# EAGLE board Hackerboat Control Board (EAGLE 6.5.0)
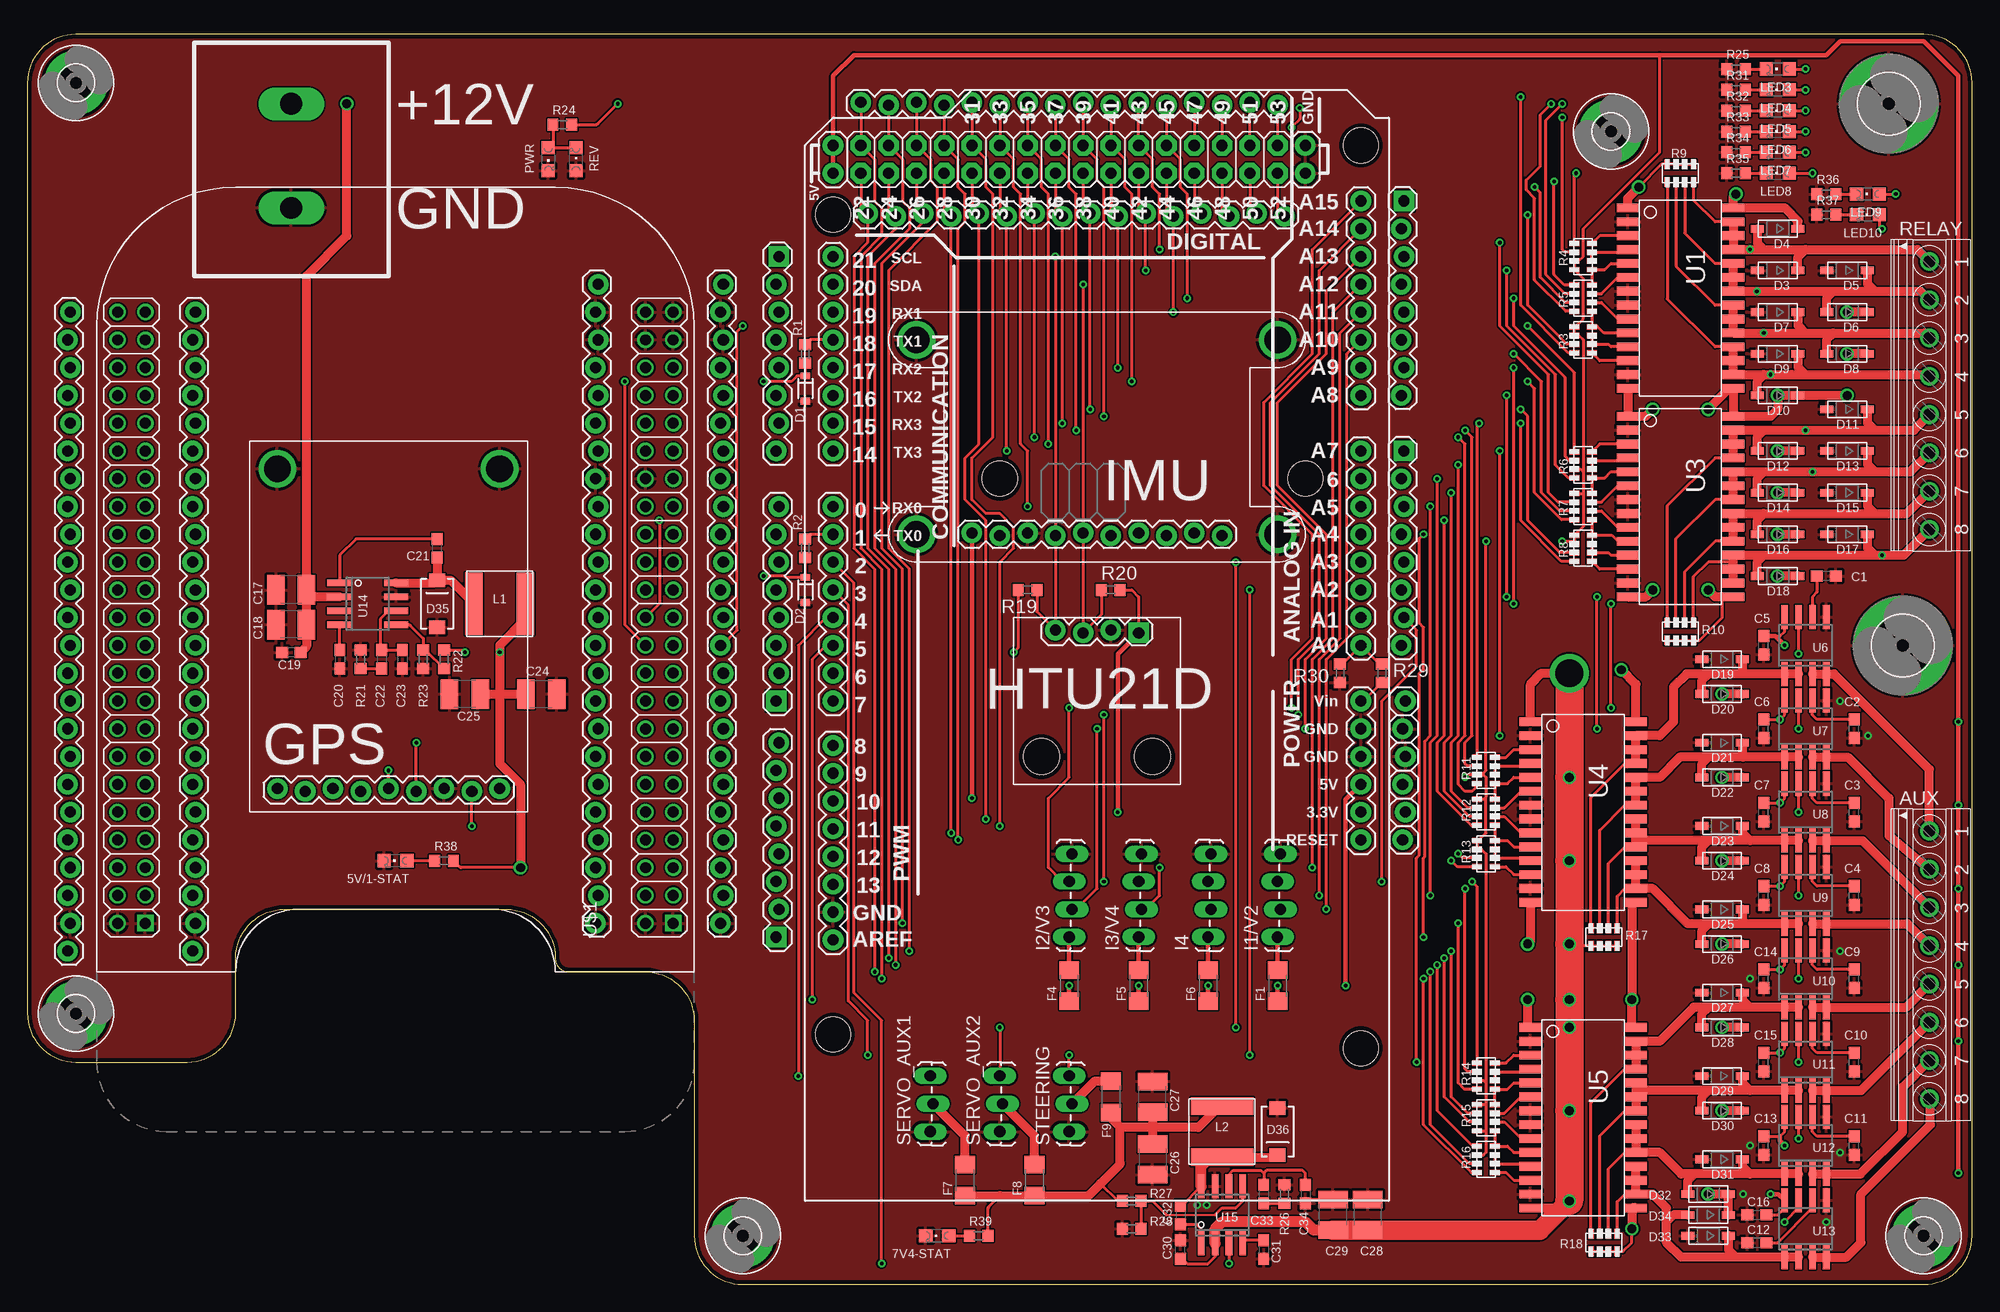
[diagram p7: board, top side]
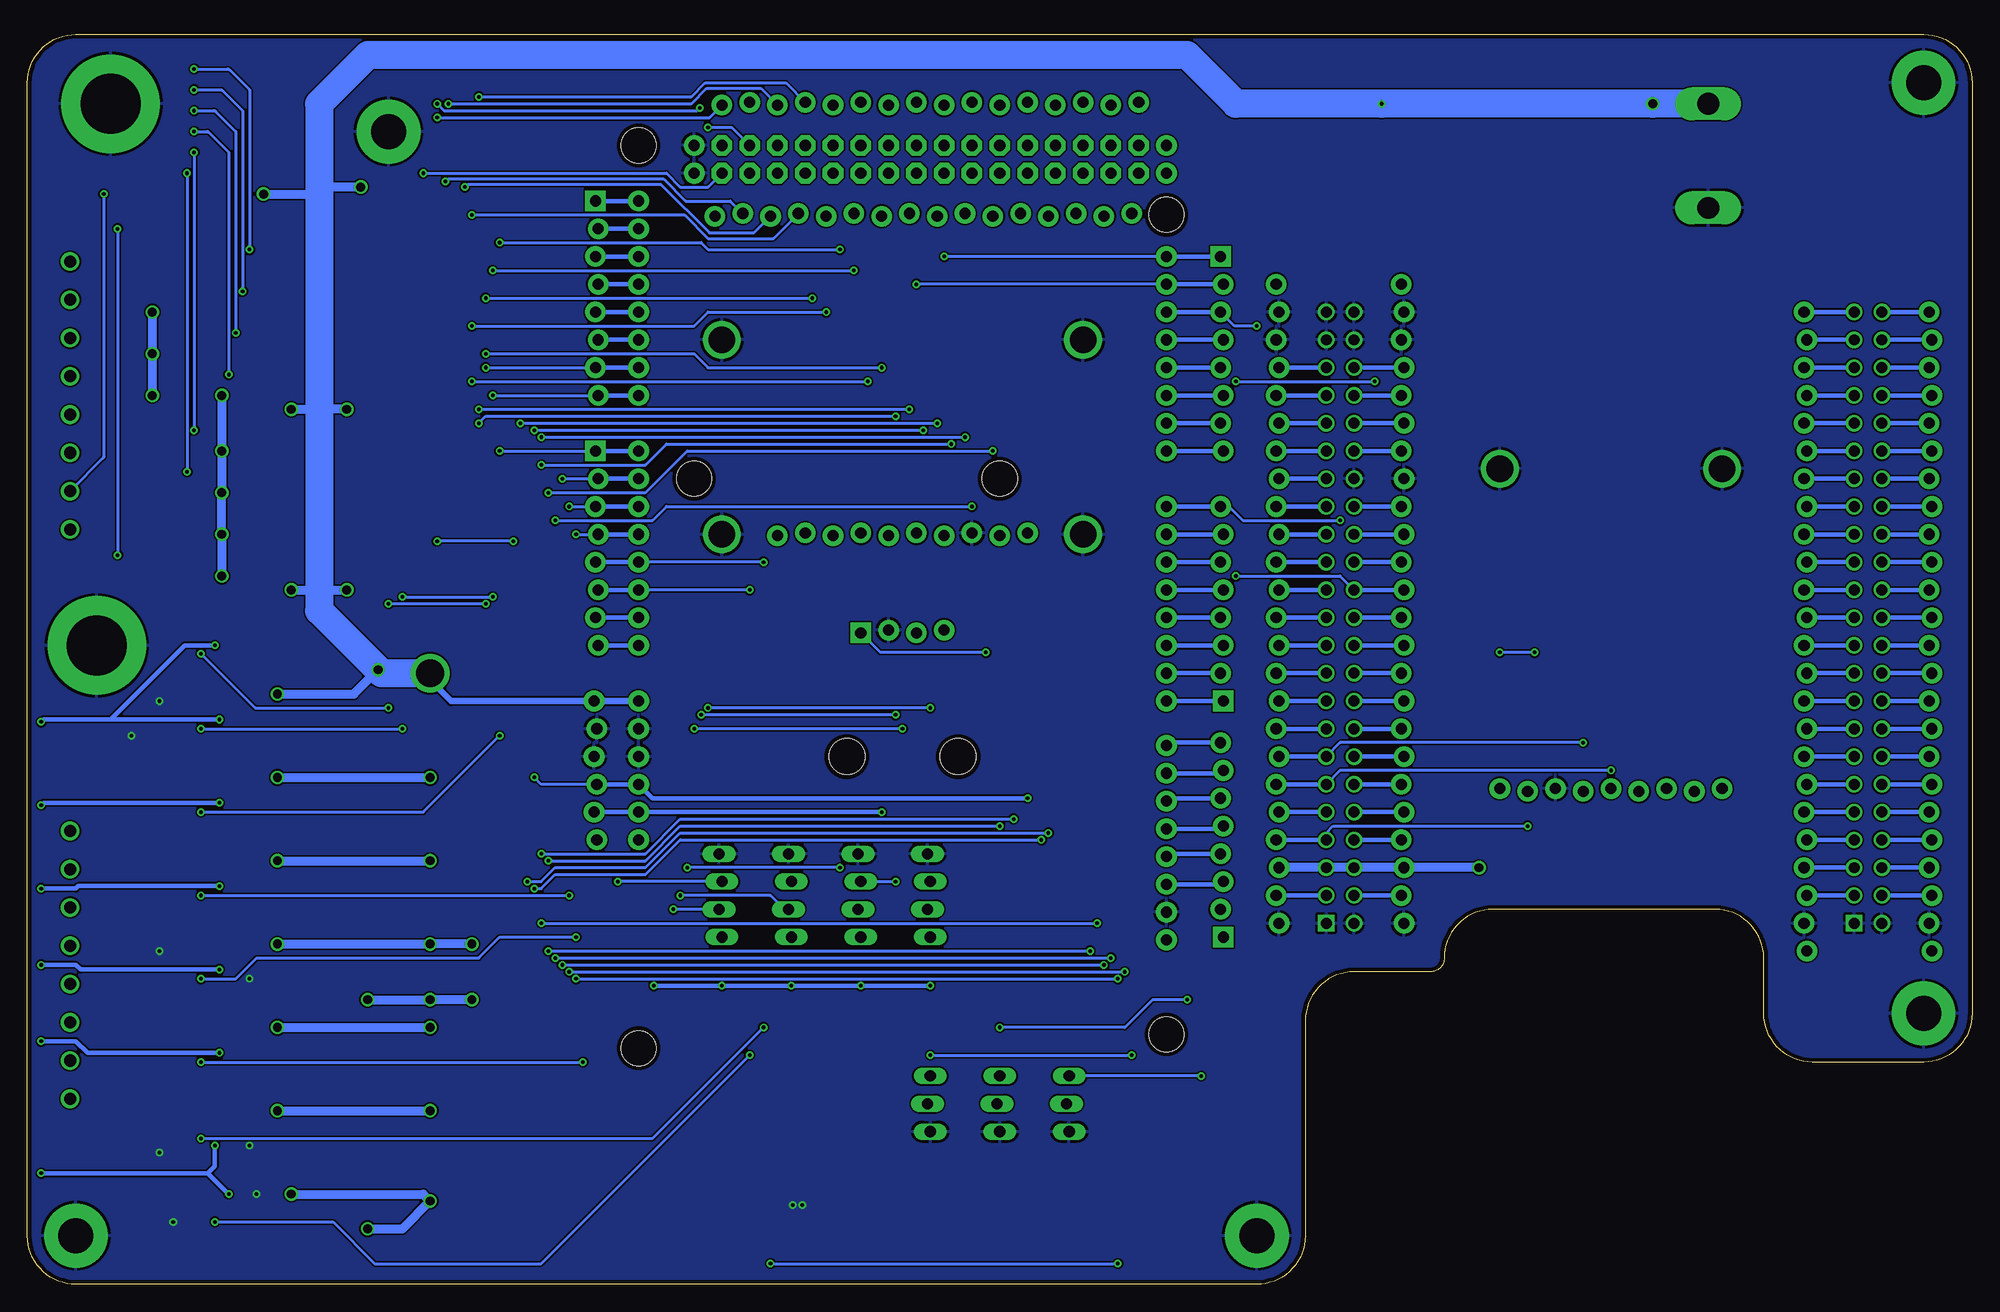
[diagram p8: board, bottom side, seen from below]

Size 177.8 x 114.3 mm. Coordinates in mm from the lower left corner, seen from the top.
Outline: 60.96,24.13 60.96,4.45 arc90 65.41,0 173.35,0 arc90 177.8,4.45 177.8,109.86 arc90 173.35,114.3 4.45,114.3 arc90 0,109.86 0,24.77 arc90 4.45,20.32 14.61,20.32 arc90 19.05,24.77 19.05,29.84 arc-90 23.5,34.29 43.81,34.29 arc-90 48.26,29.84 arc90 49.53,28.57 56.52,28.57 arc-90 60.96,24.13
Copper layers (1*16): Top 0.0356mm / dielectric 1.5011mm / Bottom 0.0356mm
Design rules "LaenPCBOrder *": minimum track width 6mil, minimum drill 13mil, track to track 6mil, track to pad 6mil, pad to pad 6mil, via to via 6mil, smd to smd 6mil, copper to edge 15mil, drill to drill 6mil, minimum pad ring 7mil, minimum via ring 7mil, stop-mask expansion 4mil, vias tented up to drill 15mil, thermal gap 10mil

## Footprints (pad centres in the part's own frame; a part is rotated, then mirrored left to right if it is on the bottom)
CHIPLED_0805 = smd 1.2 x 1.2: A 0,-1.05; C 0,1.05
1751303 = drill 1.1 pad 1.7: 1 -12.25,-0.1; 2 -8.75,-0.1; 3 -5.25,-0.1; 4 -1.75,-0.1; 5 1.75,-0.1; 6 5.25,-0.1; 7 8.75,-0.1; 8 12.25,-0.1
C0603 = smd 1.1 x 1: 1 -0.85,0; 2 0.85,0
C1210 = smd 1.6 x 2.7: 1 -1.4,0; 2 1.4,0
SOD-323 = smd 0.63 x 0.83: A 1.15,0; C -1.15,0
SOD-123 = smd 1.2 x 0.7: A 1.85,0; C -1.85,0
SPARKFUN_SMA-DIODE = smd 1.27 x 1.47: A -2.15,0; C 2.15,0
R1206 = smd 1.6 x 1.803: 1 -1.422,0; 2 1.422,0
ULTIMATE-GPS = drill 1.016 pad 1.88: 3V3 2.54,2.159; EN 5.08,1.905; FIX 10.16,1.905; GND 17.78,2.159; PPS 22.86,2.159; RX 15.24,1.905; TX 12.7,2.159; VBAT 7.62,2.159; VIN 20.32,1.905 | drill 2.438: MNT@0 2.54,31.394; MNT@1 22.86,31.394
3,2-PAD = drill 3.2 pad 5.842: B3,2 0,0
5,5-PAD = drill 5.5 pad 9: B5,5 0,0
HTU21D = drill 1.016 pad 1.88 square: 3V3 -3.81,1.397 | drill 1.016 pad 1.88: GND -1.27,1.143; SCL 3.81,1.143; SDA 1.27,1.397 | hole 3.302: -5.08,12.7; 5.08,12.7
1X04_LOCK_LONGPADS = drill 1.016 long: 1 0,0; 2 2.54,-0.254; 3 5.08,0; 4 7.62,-0.254
9-DOF-BREAKOUT = drill 1.016 pad 1.88: 3VO -8.89,2.413; GINT 1.27,2.413; GND -6.35,2.667; GRDY 3.81,2.667; LIN1 6.35,2.413; LIN2 8.89,2.667; LRDY 11.43,2.413; SCL -3.81,2.413; SDA -1.27,2.667; VIN -11.43,2.667 | drill 2.438: MNT@0 -16.51,2.54; MNT@1 -16.51,20.32; MNT@2 16.51,20.32; MNT@3 16.51,2.54
CONN-2 = drill 2 long: 1 -5.08,0; 2 4.445,0
1X08_LOCK = drill 1.016 pad 1.88 square: 1 0,0.127 | drill 1.016 pad 1.88: 2 2.54,-0.127; 3 5.08,0.127; 4 7.62,-0.127; 5 10.16,0.127; 6 12.7,-0.127; 7 15.24,0.127; 8 17.78,-0.127
1X16_LOCK = drill 1.016 pad 1.88: 1 0,0.127; 2 2.54,-0.127; 3 5.08,0.127; 4 7.62,-0.127; 5 10.16,0.127; 6 12.7,-0.127; 7 15.24,0.127; 8 17.78,-0.127; 9 20.32,0.127; 10 22.86,-0.127; 11 25.4,0.127; 12 27.94,-0.127; 13 30.48,0.127; 14 33.02,-0.127; 15 35.56,0.127; 16 38.1,-0.127
1X06_LOCK = drill 1.016 pad 1.88: 1 0,0; 2 2.54,-0.254; 3 5.08,0; 4 7.62,-0.254; 5 10.16,0; 6 12.7,-0.254
NR60XX = smd 5.7 x 1.6: 1 0,2.35; 2 0,-2.35
R0603 = smd 1 x 1.1: 1 -0.85,0; 2 0.85,0
CTS742C083-RES = smd 0.9 x 0.5: 1 -0.8,1.2; 2 0.8,1.2; 3 -0.8,0.4; 4 0.8,0.4; 5 -0.8,-0.4; 6 0.8,-0.4; 7 -0.8,-1.2; 8 0.8,-1.2
1X03_LOCK_LONGPADS = drill 1.016 long: 1 0,0; 2 2.54,-0.254; 3 5.08,0
SO-28L = smd 0.8 x 2: 1 -8.255,-4.826; 2 -6.985,-4.826; 3 -5.715,-4.826; 4 -4.445,-4.826; 5 -3.175,-4.826; 6 -1.905,-4.826; 7 -0.635,-4.826; 8 0.635,-4.826; 9 1.905,-4.826; 10 3.175,-4.826; 11 4.445,-4.826; 12 5.715,-4.826; 13 6.985,-4.826; 14 8.255,-4.826; 15 8.255,4.826; 16 6.985,4.826; 17 5.715,4.826; 18 4.445,4.826; 19 3.175,4.826; 20 1.905,4.826; 21 0.635,4.826; 22 -0.635,4.826; 23 -1.905,4.826; 24 -3.175,4.826; 25 -4.445,4.826; 26 -5.715,4.826; 27 -6.985,4.826; 28 -8.255,4.826
ARDUINO_MEGA = drill 1.016 pad 1.88: 0 63.5,50.8; 1 60.96,50.8; 2 58.42,50.8; 3 55.88,50.8; 3.3V 35.56,2.54; 4 53.34,50.8; 5 50.8,50.8; 5V@0 38.1,2.54; 5V@1 93.98,50.8; 5V@2 96.52,50.8; 6 48.26,50.8; 7 45.72,50.8; 8 41.656,50.8; 9 39.116,50.8; 10 36.576,50.8; 11 34.036,50.8; 12 31.496,50.8; 13 28.956,50.8; 14 68.58,50.8; 15 71.12,50.8; 16 73.66,50.8; 17 76.2,50.8; 18 78.74,50.8; 19 81.28,50.8; 20 83.82,50.8; 21 86.36,50.8; A0 50.8,2.54; A1 53.34,2.54; A2 55.88,2.54; A3 58.42,2.54; A4 60.96,2.54; A5 63.5,2.54; A6 66.04,2.54; A7 68.58,2.54; A8 73.66,2.54; A9 76.2,2.54; A10 78.74,2.54; A11 81.28,2.54; A12 83.82,2.54; A13 86.36,2.54; A14 88.9,2.54; A15 91.44,2.54; AREF 23.876,50.8; GND@0 40.64,2.54; GND@1 43.18,2.54; GND@2 93.98,7.62; GND@3 96.52,7.62; GND@4 26.416,50.8; RESET 33.02,2.54; VIN 45.72,2.54 | drill 1.016 pad 1.88 octagon: 22 93.98,48.26; 23 96.52,48.26; 24 93.98,45.72; 25 96.52,45.72; 26 93.98,43.18; 27 96.52,43.18; 28 93.98,40.64; 29 96.52,40.64; 30 93.98,38.1; 31 96.52,38.1; 32 93.98,35.56; 33 96.52,35.56; 34 93.98,33.02; 35 96.52,33.02; 36 93.98,30.48; 37 96.52,30.48; 38 93.98,27.94; 39 96.52,27.94; 40 93.98,25.4; 41 96.52,25.4; 42 93.98,22.86; 43 96.52,22.86; 44 93.98,20.32; 45 96.52,20.32; 46 93.98,17.78; 47 96.52,17.78; 48 93.98,15.24; 49 96.52,15.24; 50 93.98,12.7; 51 96.52,12.7; 52 93.98,10.16; 53 96.52,10.16 | hole 3.2: 15.24,50.8; 13.97,2.54; 66.04,35.56; 66.04,7.62; 90.17,50.8; 96.52,2.54
SO08 = smd 0.6 x 2.2: 1 -1.905,-2.6; 2 -0.635,-2.6; 3 0.635,-2.6; 4 1.905,-2.6; 5 1.905,2.6; 6 0.635,2.6; 7 -0.635,2.6; 8 -1.905,2.6
BEAGLEBONE_SHIELD = drill 1 square: 1 4.445,19.05; 47 52.705,19.05 | drill 1: 2 1.905,19.05; 3 4.445,21.59; 4 1.905,21.59; 5 4.445,24.13; 6 1.905,24.13; 7 4.445,26.67; 8 1.905,26.67; 9 4.445,29.21; 10 1.905,29.21; 11 4.445,31.75; 12 1.905,31.75; 13 4.445,34.29; 14 1.905,34.29; 15 4.445,36.83; 16 1.905,36.83; 17 4.445,39.37; 18 1.905,39.37; 19 4.445,41.91; 20 1.905,41.91; 21 4.445,44.45; 22 1.905,44.45; 23 4.445,46.99; 24 1.905,46.99; 25 4.445,49.53; 26 1.905,49.53; 27 4.445,52.07; 28 1.905,52.07; 29 4.445,54.61; 30 1.905,54.61; 31 4.445,57.15; 32 1.905,57.15; 33 4.445,59.69; 34 1.905,59.69; 35 4.445,62.23; 36 1.905,62.23; 37 4.445,64.77; 38 1.905,64.77; 39 4.445,67.31; 40 1.905,67.31; 41 4.445,69.85; 42 1.905,69.85; 43 4.445,72.39; 44 1.905,72.39; 45 4.445,74.93; 46 1.905,74.93; 48 50.165,19.05; 49 52.705,21.59; 50 50.165,21.59; 51 52.705,24.13; 52 50.165,24.13; 53 52.705,26.67; 54 50.165,26.67; 55 52.705,29.21; 56 50.165,29.21; 57 52.705,31.75; 58 50.165,31.75; 59 52.705,34.29; 60 50.165,34.29; 61 52.705,36.83; 62 50.165,36.83; 63 52.705,39.37; 64 50.165,39.37; 65 52.705,41.91; 66 50.165,41.91; 67 52.705,44.45; 68 50.165,44.45; 69 52.705,46.99; 70 50.165,46.99; 71 52.705,49.53; 72 50.165,49.53; 73 52.705,52.07; 74 50.165,52.07; 75 52.705,54.61; 76 50.165,54.61; 77 52.705,57.15; 78 50.165,57.15; 79 52.705,59.69; 80 50.165,59.69; 81 52.705,62.23; 82 50.165,62.23; 83 52.705,64.77; 84 50.165,64.77; 85 52.705,67.31; 86 50.165,67.31; 87 52.705,69.85; 88 50.165,69.85; 89 52.705,72.39; 90 50.165,72.39; 91 52.705,74.93; 92 50.165,74.93
1X24_LOCK = drill 1.016 pad 1.88: 2 -26.67,0.127; 3 -24.13,-0.127; 4 -21.59,0.127; 5 -19.05,-0.127; 6 -16.51,0.127; 7 -13.97,-0.127; 8 -11.43,0.127; 9 -8.89,-0.127; 10 -6.35,0.127; 11 -3.81,-0.127; 12 -1.27,0.127; 13 1.27,-0.127; 14 3.81,0.127; 15 6.35,-0.127; 16 8.89,0.127; 17 11.43,-0.127; 18 13.97,0.127; 19 16.51,-0.127; 20 19.05,0.127; 21 21.59,-0.127; 22 24.13,0.127; 23 26.67,-0.127; 24 29.21,0.127; 25 31.75,-0.127

## Placement (x,y rotation side)
5V/1-STAT  [CHIPLED_0805]  33.66,38.73 90 top
7V4-STAT  [CHIPLED_0805]  83.19,4.45 90 top
AUX  1751303  [1751303]  173.99,29.21 270 top
C1  1n  [C0603]  164.47,64.77 180 top
C2  1n  [C0603]  167,50.8 90 top
C3  1n  [C0603]  167,43.18 90 top
C4  1n  [C0603]  167,35.56 90 top
C5  100n  [C0603]  158.75,58.42 90 top
C6  100n  [C0603]  158.75,50.8 90 top
C7  100n  [C0603]  158.75,43.18 90 top
C8  100n  [C0603]  158.75,35.56 90 top
C9  1n  [C0603]  167,27.94 90 top
C10  1n  [C0603]  167,20.32 90 top
C11  1n  [C0603]  167,12.7 90 top
C12  1n  [C0603]  158.12,3.81 0 top
C13  100n  [C0603]  158.75,12.7 90 top
C14  100n  [C0603]  158.75,27.94 90 top
C15  100n  [C0603]  158.75,20.32 90 top
C16  100n  [C0603]  158.12,6.35 0 top
C17  4u7  [C1210]  24.13,63.5 180 top
C18  4u7  [C1210]  24.13,60.33 180 top
C19  10n  [C0603]  24.13,57.78 180 top
C20  2n  [C0603]  28.57,57.15 270 top
C21  100n  [C0603]  37.47,67.31 90 top
C22  [C0603]  32.38,57.15 270 top
C23  [C0603]  34.29,57.15 270 top
C24  [C1210]  46.99,53.98 0 top
C25  [C1210]  40.01,53.98 180 top
C26  [C1210]  102.87,11.43 270 top
C27  [C1210]  102.87,17.14 90 top
C28  4u7  [C1210]  122.56,6.35 90 top
C29  4u7  [C1210]  119.38,6.35 90 top
C30  10n  [C0603]  105.41,3.17 90 top
C31  2n  [C0603]  113.03,3.17 270 top
C32  100n  [C0603]  105.41,6.35 270 top
C33  [C0603]  113.03,8.26 270 top
C34  [C0603]  116.84,8.26 270 top
D1  3.3V  [SOD-323]  71.12,81.92 270 top
D2  3.3V  [SOD-323]  71.12,63.5 270 top
D3  [SOD-123]  160.02,92.71 180 top
D4  [SOD-123]  160.02,96.52 180 top
D5  [SOD-123]  166.37,92.71 180 top
D6  [SOD-123]  166.37,88.9 180 top
D7  [SOD-123]  160.02,88.9 180 top
D8  [SOD-123]  166.37,85.09 180 top
D9  [SOD-123]  160.02,85.09 180 top
D10  [SOD-123]  160.02,81.28 180 top
D11  [SOD-123]  166.37,80.01 180 top
D12  [SOD-123]  160.02,76.2 180 top
D13  [SOD-123]  166.37,76.2 180 top
D14  [SOD-123]  160.02,72.39 180 top
D15  [SOD-123]  166.37,72.39 180 top
D16  [SOD-123]  160.02,68.58 180 top
D17  [SOD-123]  166.37,68.58 180 top
D18  [SOD-123]  160.02,64.77 180 top
D19  [SOD-123]  154.94,57.15 180 top
D20  [SOD-123]  154.94,53.98 180 top
D21  [SOD-123]  154.94,49.53 180 top
D22  [SOD-123]  154.94,46.35 180 top
D23  [SOD-123]  154.94,41.91 180 top
D24  [SOD-123]  154.94,38.73 180 top
D25  [SOD-123]  154.94,34.29 180 top
D26  [SOD-123]  154.94,31.11 180 top
D27  [SOD-123]  154.94,26.67 180 top
D28  [SOD-123]  154.94,23.5 180 top
D29  [SOD-123]  154.94,19.05 180 top
D30  [SOD-123]  154.94,15.88 180 top
D31  [SOD-123]  154.94,11.43 180 top
D32  [SOD-123]  153.67,8.26 180 top
D33  [SOD-123]  153.67,4.45 180 top
D34  [SOD-123]  153.67,6.35 180 top
D35  [SPARKFUN_SMA-DIODE]  37.47,62.23 90 top
D36  [SPARKFUN_SMA-DIODE]  114.3,13.97 270 top
F1  [R1206]  114.3,27.3 90 top
F4  [R1206]  95.25,27.3 90 top
F5  [R1206]  101.6,27.3 90 top
F6  [R1206]  107.95,27.3 90 top
F7  [R1206]  85.72,9.53 90 top
F8  [R1206]  92.08,9.53 90 top
F9  [R1206]  99.06,17.14 90 top
GPS  ULTIMATE-GPS  [ULTIMATE-GPS]  20.32,43.18 0 top
H1  MOUNT-PAD-ROUND3.2  [3,2-PAD]  173.35,4.45 0 top
H2  MOUNT-PAD-ROUND3.2  [3,2-PAD]  144.78,105.41 0 top
H3  MOUNT-PAD-ROUND3.2  [3,2-PAD]  65.41,4.45 0 top
H4  MOUNT-PAD-ROUND3.2  [3,2-PAD]  4.45,109.86 0 top
H5  MOUNT-PAD-ROUND5.5  [5,5-PAD]  171.45,58.42 0 top
H6  MOUNT-PAD-ROUND5.5  [5,5-PAD]  170.18,107.95 0 top
H7  MOUNT-PAD-ROUND3.2  [3,2-PAD]  4.45,24.77 0 top
HTU21D  HTU21D  [HTU21D]  97.79,60.96 180 top
I1/V2  [1X04_LOCK_LONGPADS]  114.3,31.75 90 top
I2/V3  [1X04_LOCK_LONGPADS]  95.25,31.75 90 top
I3/V4  [1X04_LOCK_LONGPADS]  101.6,31.75 90 top
I4  [1X04_LOCK_LONGPADS]  107.95,31.75 90 top
IMU  9-DOF-BREAKOUT  [9-DOF-BREAKOUT]  97.79,66.04 0 top
J3  3-1437664-0  [CONN-2]  24.13,102.87 270 top
JP10  [1X08_LOCK]  68.58,53.34 90 top
JP11  [1X08_LOCK]  125.73,76.2 270 top
JP12  [1X08_LOCK]  125.73,99.06 270 top
JP13  [1X08_LOCK]  68.58,93.98 270 top
JP14  [1X08_LOCK]  68.58,31.75 90 top
JP15  M16LOCK  [1X16_LOCK]  114.94,97.79 180 top
JP16  M16LOCK  [1X16_LOCK]  114.3,107.95 180 top
JP17  [1X06_LOCK]  125.73,40.64 90 top
L1  NR6045  [NR60XX]  43.18,62.23 90 top
L2  NR6045  [NR60XX]  109.22,13.97 180 top
LED3  [CHIPLED_0805]  160.02,111.12 90 top
LED4  [CHIPLED_0805]  160.02,109.22 90 top
LED5  [CHIPLED_0805]  160.02,107.31 90 top
LED6  [CHIPLED_0805]  160.02,105.41 90 top
LED7  [CHIPLED_0805]  160.02,103.5 90 top
LED8  [CHIPLED_0805]  160.02,101.6 90 top
LED9  [CHIPLED_0805]  168.28,99.69 90 top
LED10  [CHIPLED_0805]  168.28,97.79 90 top
PWR  [CHIPLED_0805]  47.62,102.87 180 top
R1  1K  [R0603]  71.12,85.09 270 top
R2  1K  [R0603]  71.12,67.31 90 top
R3  10K  [CTS742C083-RES]  142.24,86.36 0 top
R4  10k  [CTS742C083-RES]  142.24,93.98 0 top
R5  10K  [CTS742C083-RES]  142.24,90.17 0 top
R6  10K  [CTS742C083-RES]  142.24,74.93 0 top
R7  10K  [CTS742C083-RES]  142.24,71.12 0 top
R8  10K  [CTS742C083-RES]  142.24,67.31 0 top
R9  100K  [CTS742C083-RES]  151.13,101.6 90 top
R10  100K  [CTS742C083-RES]  151.13,59.69 270 top
R11  10K  [CTS742C083-RES]  133.35,46.99 0 top
R12  10K  [CTS742C083-RES]  133.35,43.18 0 top
R13  10K  [CTS742C083-RES]  133.35,39.37 0 top
R14  10K  [CTS742C083-RES]  133.35,19.05 0 top
R15  10K  [CTS742C083-RES]  133.35,15.24 0 top
R16  10K  [CTS742C083-RES]  133.35,11.43 0 top
R17  100K  [CTS742C083-RES]  144.15,31.75 270 top
R18  100K  [CTS742C083-RES]  144.15,3.81 270 top
R19  4K7'  [R0603]  91.44,63.5 180 top
R20  4K7  [R0603]  99.06,63.5 0 top
R21  [R0603]  30.48,57.15 270 top
R22  [R0603]  38.1,57.15 90 top
R23  [R0603]  36.2,57.15 90 top
R24  [R0603]  48.9,106.05 0 top
R25  [R0603]  156.21,111.12 0 top
R26  [R0603]  114.94,8.26 270 top
R27  [R0603]  100.97,7.62 180 top
R28  [R0603]  100.97,5.08 0 top
R29  15K  [R0603]  123.83,55.88 270 top
R30  10K  [R0603]  120.02,55.88 90 top
R31  [R0603]  156.21,109.22 0 top
R32  [R0603]  156.21,107.31 0 top
R33  [R0603]  156.21,105.41 0 top
R34  [R0603]  156.21,103.5 0 top
R35  [R0603]  156.21,101.6 0 top
R36  [R0603]  164.47,99.69 0 top
R37  [R0603]  164.47,97.79 0 top
R38  [R0603]  38.1,38.73 0 top
R39  [R0603]  87,4.45 0 top
RELAY  1751303  [1751303]  173.99,81.28 270 top
REV  [CHIPLED_0805]  50.16,102.87 0 top
SERVO_AUX1  [1X03_LOCK_LONGPADS]  82.55,13.97 90 top
SERVO_AUX2  [1X03_LOCK_LONGPADS]  88.9,13.97 90 top
STEERING  [1X03_LOCK_LONGPADS]  95.25,13.97 90 top
U1  IPS6044  [SO-28L]  151.13,90.17 270 top
U2  ARDUINO-MEGAFULL  [ARDUINO_MEGA]  124.46,7.62 90 top
U3  IPS6044  [SO-28L]  151.13,71.12 270 top
U4  IPS6044  [SO-28L]  142.24,43.18 270 top
U5  IPS6044  [SO-28L]  142.24,15.24 270 top
U6  [SO08]  162.56,58.42 0 top
U7  [SO08]  162.56,50.8 0 top
U8  [SO08]  162.56,43.18 0 top
U9  [SO08]  162.56,35.56 0 top
U10  [SO08]  162.56,27.94 0 top
U11  [SO08]  162.56,20.32 0 top
U12  [SO08]  162.56,12.7 0 top
U13  [SO08]  162.56,5.08 0 top
U14  TPS54331  [SO08]  31.11,62.23 270 top
U15  TPS54331  [SO08]  109.22,6.35 0 top
U$1  BEAGLEBONE_OUTLINE  [BEAGLEBONE_SHIELD]  6.35,13.97 0 top
U$2  M24LOCK  [1X24_LOCK]  52.07,64.77 270 top
U$3  M24LOCK  [1X24_LOCK]  3.81,62.23 270 top
U$4  M24LOCK  [1X24_LOCK]  15.24,62.23 270 top
U$5  M24LOCK  [1X24_LOCK]  63.5,64.77 270 top

## Tracks (layer width: path | path; a pad name or v marks a point on that pad's centre or on a via)
7V4
  Top 0.254: R27.2 99.69,7.62 98.11,9.21 | R39.2 87.84,6.94 arc-45 87.92,7.12 88.9,8.1
  Top 0.813: F7.1 88.9,8.1 F8.1 97,8.1 98.11,9.21 99.83,10.93 arc45 99.9,11.11 99.9,14.36 arc45 99.88,14.43 | L2.2 109.03,16.32 107.06,14.35 102.87,14.35 | C27.1 102.87,14.35 | 102.87,14.35 C26.1 | 102.87,14.35 100.05,14.35 arc-45 99.88,14.43 | 99.88,14.43 99.06,15.24 F9.1
13
  Bottom 0.406: U2.13 68.71,36.58 JP14.3
+3V3  (via drill 0.33)
  Top 0.254: R19.2 90.59,58.2 v90.17,57.78 | R20.2 100.97,63.5 101.6,62.87 HTU21D.3V3
  Top 0.406: v99.69,43.18 99.69,57.66 HTU21D.3V3
  Bottom 0.254: v90.17,57.78 99.82,57.78 HTU21D.3V3
  Bottom 0.406: JP17.2 U2.3.3V v99.69,43.18
+5V  (via drill 0.33)
  Top 0.254: C5.2 160.24,59.27 160.66,59.69 U6.8 | C6.2 v160.24,51.65 160.66,52.07 U7.8 | C8.2 v160.24,36.41 160.66,36.83 U9.8 | C7.2 v160.24,44.03 160.66,44.45 U8.8 | C13.2 160.24,13.55 160.66,13.97 U12.8 | C16.2 160.02,6.35 160.66,6.99 U13.8 | C15.2 v160.24,21.17 160.66,21.59 U11.8 | C14.2 v160.24,28.79 160.66,29.21 U10.8 | 133.12,46.59 R11.5 131.68,46.59 v131.44,46.35 | 133.12,46.59 133.35,46.35 133.35,44.58 | R12.1 133.15,44.38 133.35,44.58 | 133.35,44.58 133.35,41.27 132.65,40.57 R13.1 R13.3 132.95,39.77 133.35,39.37 133.35,18.41 | 142.24,74.3 142.24,86.36 141.84,86.76 R3.3 R3.1 141.53,87.56 142.24,88.27 142.24,91.98 R4.7 R4.5 141.84,93.58 142.24,93.98 142.24,96.52 149.22,103.5 149.22,112.39 | 142.24,74.3 142.24,72.39 | 142.24,72.39 142.24,69.31 R8.1 R8.3 141.21,67.94 v140.34,67.94 | R7.1 142.17,72.32 142.24,72.39 | R6.5 142,74.53 142.24,74.3 | 133.12,46.59 133.12,46.76 133.35,46.99 v133.35,67.94 | 133.35,18.41 133.35,16.51 | 133.35,16.51 133.35,13.97 | 133.35,13.97 133.35,12.06 133.12,11.83 R16.3 | R15.1 133.28,16.44 133.35,16.51 | R14.5 133.12,18.65 133.35,18.41 | R15.7 133.28,14.04 133.35,13.97
  Top 0.406: v120.52,27.3 120.52,44.32 U2.5V@0 | IMU.VIN v86.36,44.45 | v176.53,10.16 v176.53,22.23 v176.53,29.21 v176.53,36.2 v176.53,43.81 v176.53,51.44 176.53,110.49 173.35,113.67 165.74,113.67 164.47,112.39 149.22,112.39 75.56,112.39 73.66,110.49 U2.5V@2 U2.5V@1 | v159.38,8.26 160.08,8.26 U13.8 | 160.24,13.55 160.24,13.12 v160.66,12.7 | C5.2 159.81,59.27 v160.66,58.42 | F4.1 v95.25,27.3 | F5.1 v101.6,27.3 | F6.1 v107.95,27.3 | F1.1 v114.3,27.3
  Bottom 0.254: JP17.3 130.81,45.72 v131.44,46.35 | v133.35,67.94 v140.34,67.94
  Bottom 0.406: JP17.3 U2.5V@0 120.65,44.45 v86.36,44.45 | v176.53,10.16 161.29,10.16 | 161.29,10.16 v159.38,8.26 | v160.66,12.7 160.66,10.79 161.29,10.16 | v160.24,21.17 172.3,21.17 173.35,22.23 v176.53,22.23 | v160.24,28.79 172.94,28.79 173.35,29.21 v176.53,29.21 | v160.24,36.41 173.14,36.41 173.35,36.2 v176.53,36.2 | v160.24,44.03 176.31,44.03 v176.53,43.81 | v160.24,51.65 170.18,51.65 | 170.18,51.65 176.31,51.65 v176.53,51.44 | v160.66,58.42 163.41,58.42 170.18,51.65 | v95.25,27.3 v101.6,27.3 v107.95,27.3 v114.3,27.3 v120.52,27.3
+5V/1  (via drill 0.33, 0.81)
  Top 0.254: R22.2 39.69,58 arc-45 39.86,57.93 v40.01,57.78 | v45.09,38.1 39.69,38.1 arc-45 39.51,38.17 R38.2
  Top 0.813: 43.18,53.98 C24.1 | L1.2 45.53,60.77 43.18,58.42 v43.18,57.78 43.18,53.98 | 43.18,53.98 43.18,47.62 45.09,45.72 v45.09,38.1 | C25.1 43.18,53.98
  Bottom 0.254: v40.01,57.78 v43.18,57.78
  Bottom 0.813: v45.09,38.1 U$2.23 U$1.52 U$1.51 U$5.23
+12V  (via drill 0.33, 0.81, 2.54)
  Top 0.254: R9.8 R9.6 R9.4 R9.2 149.39,102.4 v147.32,100.33 | R10.8 R10.6 R10.4 R10.2 152.87,58.89 154.94,60.96 154.94,62.87 | R17.2 R17.4 R17.6 R17.8 141.13,30.95 v140.97,31.11 | R18.8 R18.6 R18.4 R18.2 145.88,3.01 146.69,3.81 v146.69,5.08 | C30.1 105.62,2.33 106.05,1.91 107.95,1.91 108.58,2.54 U15.2 | U2.VIN 122.14,53.34 R29.2 | R24.2 51.97,106.05 arc45 52.14,106.12 v53.98,107.95
  Top 0.813: D4.C 161.87,97.21 160.66,98.42 U1.28 155.96,99.44 v156.21,99.69 | U1.1 146.3,99.31 v147.32,100.33 | D6.C v166.37,88.9 | D8.C v166.37,85.09 | v166.37,81.28 D10.C v160.02,81.28 160.02,80.01 159.38,79.38 U3.28 U1.15 155.57,81.92 v153.67,80.01 | D18.C v160.02,64.77 | D16.C v160.02,68.58 | D14.C v160.02,72.39 | D12.C v160.02,76.2 | U1.14 U3.1 147.96,79.38 v148.59,80.01 | U3.14 147.96,62.87 v148.59,63.5 | U3.15 154.94,62.87 154.31,62.87 v153.67,63.5 | U4.28 147.07,54.86 v145.73,56.2 | U4.1 137.41,54.86 138.43,55.88 v140.97,55.88 | U4.14 137.41,31.37 v137.16,31.11 | U5.1 137.16,23.5 v137.16,26.04 | U5.28 146.69,23.5 v146.69,26.04 146.69,34.92 U4.15 | U5.14 140.97,6.99 v140.97,7.62 | U5.15 146.69,6.99 v146.69,5.08 | U14.2 26.16,62.87 C17.1 | C17.1 C18.1 25.53,58.34 C19.1 | C17.1 25.53,92.2 29.21,95.89 v29.21,107.95 | D20.C v154.94,53.98 | D22.C v154.94,46.35 | D24.C v154.94,38.73 | D26.C v154.94,31.11 | D28.C v154.94,23.5 | D30.C v154.94,15.88 | v153.67,8.26 D32.C D34.C
  Top 1.016: C29.1 117.61,4.95 116.84,5.71 109.22,5.71 108.58,5.08 U15.2
  Top 1.778: v140.97,7.62 138.3,4.95 C28.1 C29.1
  Top 2.54: v140.97,55.88 v140.97,46.35 v140.97,38.73 v140.97,31.11 v140.97,26.04 v140.97,23.5 v140.97,15.88 v140.97,7.62
  Bottom 0.61: U2.VIN JP17.6 139.06,53.34 140.97,55.24 v140.97,55.88
  Bottom 0.813: v156.21,99.69 151.13,99.69 150.5,100.33 v147.32,100.33 | v166.37,88.9 v166.37,85.09 v166.37,81.28 | v160.02,81.28 v160.02,76.2 v160.02,72.39 v160.02,68.58 v160.02,64.77 | v153.67,80.01 151.13,80.01 v148.59,80.01 | v153.67,63.5 151.13,63.5 v148.59,63.5 | v137.16,31.11 v140.97,31.11 141.13,30.95 140.97,30.95 141.13,31.11 v154.94,31.11 | v137.16,26.04 v140.97,26.04 v146.69,26.04 | v146.69,5.08 143.51,5.08 v140.97,7.62 141.6,8.26 v153.67,8.26 | v154.94,53.98 147.96,53.98 v145.73,56.2 | v154.94,46.35 v140.97,46.35 | v154.94,38.73 v140.97,38.73 | v154.94,23.5 v140.97,23.5 | v154.94,15.88 v140.97,15.88
  Bottom 2.54: J3.1 v29.21,107.95 v53.98,107.95 67.31,107.95 71.75,112.39 146.69,112.39 151.13,107.95 151.13,99.69 151.13,80.01 151.13,63.5 151.13,61.59 v145.73,56.2 145.41,55.88 v140.97,55.88
AUX1  (via drill 0.33)
  Top 0.254: U2.36 93.98,98.3 JP15.9 v94.61,78.74 | R11.1 132.55,78.58 v132.72,78.74
  Bottom 0.254: v132.72,78.74 v94.61,78.74
AUX1FB  (via drill 0.33)
  Top 0.254: JP16.9 U2.37 95.25,102.87 95.25,100.33 95.89,99.69 v95.89,78.11 | R11.3 131.68,47.39 131.44,47.62 131.44,49.53 132.08,50.16 132.08,77.47 v131.44,78.11
  Bottom 0.254: v131.44,78.11 v95.89,78.11
AUX1I  (via drill 0.33)
  Top 0.254: U6.7 v161.93,57.66 | v144.78,52.7 v144.78,62.23 | v135.89,62.23 v135.89,83.82
  Bottom 0.254: v161.93,57.66 156.97,52.7 v144.78,52.7 | v144.78,62.23 v135.89,62.23 | v135.89,83.82 JP12.7
  Bottom 0.406: JP12.7 U2.A9
AUX2  (via drill 0.33)
  Top 0.254: JP16.10 U2.35 92.71,102.87 92.71,100.33 93.34,99.69 v93.34,76.83 | R12.3 131.68,43.58 130.18,45.09 130.18,49.53 130.81,50.16 v130.81,74.93
  Bottom 0.254: v130.81,74.93 121.28,74.93 119.38,76.83 v93.34,76.83
AUX2FB  (via drill 0.33)
  Top 0.254: U2.34 91.44,98.55 JP15.10 v92.08,77.47 | v130.81,77.47 131.44,76.83 131.44,50.16 130.81,49.53 130.81,45.72 131.44,45.09 132.08,45.09 132.55,45.55 R11.7
  Bottom 0.254: v130.81,77.47 v92.08,77.47
AUX2I  (via drill 0.33)
  Top 0.254: U7.7 v161.93,50.8 | v143.51,50.8 v143.51,62.87 | v135.25,62.87 v135.25,81.28
  Bottom 0.254: v161.93,50.8 v143.51,50.8 | v143.51,62.87 v135.25,62.87 | v135.25,81.28 JP12.8
  Bottom 0.406: U2.A8 JP12.8
AUX3  (via drill 0.33)
  Top 0.254: U2.32 88.9,98.3 JP15.11 v89.53,76.2 | R12.5 131.84,42.78 129.54,45.09 129.54,49.53 130.18,50.16 v130.18,72.39
  Bottom 0.254: v130.18,72.39 121.28,72.39 117.47,76.2 v89.53,76.2
AUX3FB  (via drill 0.33)
  Top 0.254: JP16.11 U2.33 90.17,102.87 90.17,100.33 90.81,99.69 90.81,76.83 91.44,76.2 v91.44,71.12 | R12.7 132.01,41.98 128.91,45.09 128.91,49.53 129.54,50.16 v129.54,69.85
  Bottom 0.254: v129.54,69.85 120.65,69.85 119.38,71.12 v91.44,71.12
AUX3I  (via drill 0.33)
  Top 0.254: U8.7 v161.93,43.18 | v134.62,50.16 v134.62,76.2
  Bottom 0.254: v161.93,43.18 141.6,43.18 v134.62,50.16 | v134.62,76.2 JP11.1
  Bottom 0.406: JP11.1 U2.A7
AUX4  (via drill 0.33)
  Top 0.254: JP16.12 U2.31 87.63,102.87 87.63,100.33 88.27,99.69 88.27,77.47 86.36,75.56 86.36,71.75 87.63,70.48 88.9,70.48 90.17,69.22 90.17,67.31 88.9,66.04 v88.9,41.91 | R13.7 130.74,38.17 v130.18,38.73
  Bottom 0.254: v130.18,38.73 121.28,38.73 118.11,41.91 v88.9,41.91
AUX4FB  (via drill 0.33)
  Top 0.254: U2.30 86.36,98.55 JP15.12 87,76.83 85.72,75.56 85.72,71.75 87.63,69.85 v87.63,42.55 | R13.5 131.21,38.97 v130.81,39.37
  Bottom 0.254: v130.81,39.37 121.28,39.37 118.11,42.55 v87.63,42.55
AUX4I  (via drill 0.33)
  Top 0.254: U9.7 v161.93,35.56 | v128.27,35.56 128.27,49.53 128.91,50.16 v128.91,73.66
  Bottom 0.254: v161.93,35.56 v128.27,35.56 | v128.91,73.66 JP11.2
  Bottom 0.406: U2.A6 JP11.2
AUX5  (via drill 0.33)
  Top 0.254: U2.28 83.82,98.3 JP15.13 v84.45,41.27 | R14.1 132.55,36.36 v132.08,36.83
  Bottom 0.254: v132.08,36.83 130.81,36.83 129.54,38.1 121.28,38.1 118.11,41.27 v84.45,41.27
AUX5FB  (via drill 0.33)
  Top 0.254: JP16.13 U2.29 85.09,102.87 85.09,100.33 85.72,99.69 85.72,97.16 85.09,96.52 v85.09,40.64 | R14.3 131.68,19.45 131.44,19.68 v131.44,36.2
  Bottom 0.254: v131.44,36.2 130.81,36.2 129.54,37.47 121.28,37.47 118.11,40.64 v85.09,40.64
AUX5I  (via drill 0.33)
  Top 0.254: U10.7 v161.93,27.94 | v127.64,31.75 127.64,38.99 127.76,39.12 127.76,49.66 128.27,50.16 v128.27,71.12
  Bottom 0.254: v161.93,27.94 158.75,27.94 156.84,29.84 136.53,29.84 134.62,31.75 v127.64,31.75 | v128.27,71.12 JP11.3
  Bottom 0.406: JP11.3 U2.A5
AUX6  (via drill 0.33)
  Top 0.254: JP16.14 U2.27 82.55,102.87 82.55,100.97 83.19,100.33 83.19,97.16 78.74,92.71 78.74,67.31 80.64,65.41 v80.64,30.48 | R15.3 131.68,15.64 130.18,17.14 v130.18,30.48
  Bottom 0.254: v130.18,30.48 v80.64,30.48
AUX6FB  (via drill 0.33)
  Top 0.254: U2.26 81.28,98.55 JP15.14 81.92,97.16 78.11,93.34 78.11,67.31 80.01,65.41 v80.01,33.02 | R14.7 131.38,17.85 130.81,18.41 v130.81,33.02
  Bottom 0.254: v130.81,33.02 v80.01,33.02
AUX6I  (via drill 0.33)
  Top 0.254: U11.7 v161.93,20.32 | v127,20.32 127,38.99 127.25,39.24 127.25,55.88 127.64,56.26 127.64,60.07 127.25,60.45 127.25,68.2 v127.64,68.58
  Bottom 0.254: v161.93,20.32 v127,20.32 | v127.64,68.58 125.09,68.58
  Bottom 0.406: U2.A4 125.09,68.58 JP11.4
AUX7  (via drill 0.33)
  Top 0.254: U2.24 78.74,98.3 JP15.15 79.38,96.52 76.83,93.98 76.83,67.31 78.74,65.41 v78.74,29.84 | R15.5 131.84,14.84 129.54,17.14 v129.54,29.84
  Bottom 0.254: v129.54,29.84 v78.74,29.84
AUX7FB  (via drill 0.33)
  Top 0.254: JP16.15 U2.25 80.01,102.87 80.01,99.06 80.64,98.42 80.64,96.52 77.47,93.34 77.47,67.31 79.38,65.41 v79.38,29.21 | R16.1 132.15,12.63 128.91,15.88 v128.91,29.21
  Bottom 0.254: v128.91,29.21 v79.38,29.21
AUX7I  (via drill 0.33)
  Top 0.254: U12.7 v161.93,13.34 | v110.49,23.5 v110.49,66.04
  Bottom 0.254: v161.93,13.34 120.65,13.34 v110.49,23.5 | v110.49,66.04 U2.A3
  Bottom 0.406: U2.A3 JP11.5
AUX8  (via drill 0.33)
  Top 0.254: JP16.16 U2.23 77.47,102.87 77.47,99.06 78.11,98.42 78.11,95.89 76.2,93.98 76.2,67.31 78.11,65.41 v78.11,27.94 | R16.7 132.01,10.23 127.64,14.61 v127.64,27.94
  Bottom 0.254: v127.64,27.94 v78.11,27.94
AUX8FB  (via drill 0.33)
  Top 0.254: U2.22 76.2,98.55 JP15.16 76.83,95.25 75.56,93.98 75.56,67.31 77.47,65.41 v77.47,28.57 | R16.5 131.84,11.03 128.27,14.61 v128.27,28.57
  Bottom 0.254: v128.27,28.57 v77.47,28.57
AUX8I  (via drill 0.33)
  Top 0.254: U13.7 161.93,6.99 v160.66,5.71 | v111.76,20.95 v111.76,63.5
  Bottom 0.254: v160.66,5.71 149.86,5.71 146.05,1.91 130.81,1.91 v111.76,20.95 | v111.76,63.5 U2.A2
  Bottom 0.406: JP11.6 U2.A2
GND  (via drill 0.33)
  Top 0.254: C29.2 117.19,7.75 C34.2
  other vias: 106.93,7.24 107.82,7.24 164.47,5.71 165.74,12.06 156.84,8.26 157.48,12.7 157.48,27.94 165.74,30.48 168.28,50.16 165.74,53.34
  pour Bottom: 0,0 177.8,0 177.8,114.3 0,114.3
  pour Top: 0,0 177.8,0 177.8,114.3 0,114.3
GNSS_RX  (via drill 0.33)
  Top 0.254: GPS.RX v35.56,49.53
  Bottom 0.254: v35.56,49.53 57.78,49.53 U$1.59
  Bottom 0.406: U$1.59 U$5.19
GNSS_TX  (via drill 0.33)
  Top 0.254: GPS.TX v33.02,46.99
  Bottom 0.254: v33.02,46.99 57.78,46.99 U$1.57
  Bottom 0.406: U$1.57 U$5.20
I1  (via drill 0.33)
  Top 0.254: v118.75,34.29 118.75,57.15 120.65,59.05 120.65,85.09 U2.A10
  Bottom 0.254: I1/V2.2 v118.75,34.29
  Bottom 0.406: U2.A10 JP12.6
I2  (via drill 0.33)
  Top 0.254: I2/V3.2 95.89,34.29 97.79,36.2 v97.79,50.8 | v116.84,50.8 116.84,57.15 118.75,59.05 118.75,68.58 114.3,73.03 114.3,80.64 118.75,85.09 118.75,90.81 U2.A13
  Bottom 0.254: v97.79,50.8 v116.84,50.8
  Bottom 0.406: JP12.3 U2.A13
I3  (via drill 0.33)
  Top 0.254: I3/V4.2 102.23,34.29 103.5,35.56 v103.5,38.1 | v117.47,38.1 117.47,57.15 119.38,59.05 119.38,88.9 U2.A12
  Bottom 0.254: v103.5,38.1 v117.47,38.1
  Bottom 0.406: U2.A12 JP12.4
I4  (via drill 0.33)
  Top 0.254: v118.11,35.56 118.11,57.15 120.02,59.05 120.02,87 U2.A11
  Bottom 0.254: I4.2 108.58,34.29 109.86,35.56 v118.11,35.56
  Bottom 0.406: JP12.5 U2.A11
N$3
  Top 0.254: U2.18 71.54,86.36 R1.1
  Bottom 0.406: U2.18 JP13.4
N$4
  Top 0.254: U2.1 71.54,68.58 R2.2
  Bottom 0.406: JP10.7 U2.1
N$5
  Top 0.254: U3.3 143.75,76.83 R6.2
N$6
  Top 0.254: U3.12 143.75,65.41 R8.8
N$7
  Top 0.254: R7.6 143.91,70.72 145.41,69.22 U3.9
N$8  (via drill 0.33)
  Top 0.254: R9.7 152.33,99.13 154.31,97.16 U1.27 | LED3.A v162.56,111.12
  Top 0.813: U1.27 U1.26 U1.25 v157.48,94.61 158.12,94.61 158.75,94.61 | 158.75,94.61 162.56,94.61 | 162.56,94.61 172.81,94.61 RELAY.1 | D3.C 161.87,93.92 162.56,94.61 | D4.A 158.17,95.19 158.75,94.61
  Bottom 0.254: v162.56,111.12 159.49,111.12 arc45 159.31,111.05 157.48,109.22 v157.48,94.61
N$9  (via drill 0.33)
  Top 0.254: R9.5 151.53,96.12 154.31,93.34 U1.24 | LED4.A v162.56,109.22
  Top 0.813: 165.1,90.81 159.38,90.81 v158.12,90.81 U1.22 U1.23 U1.24 | 165.1,90.81 168.91,90.81 | 168.91,90.81 173.12,90.81 RELAY.2 | D5.C 168.22,91.5 168.91,90.81 | D6.A 164.52,90.22 165.1,90.81
  Bottom 0.254: v162.56,109.22 160.12,109.22 arc45 159.95,109.15 158.12,107.31 v158.12,90.81
N$10  (via drill 0.33)
  Top 0.254: R9.3 150.73,93.11 154.31,89.53 U1.21 | LED5.A v162.56,107.31
  Top 0.813: 162.56,87 160.66,87 v158.75,87 U1.19 U1.20 U1.21 | 162.56,87 165.1,87 | 165.1,87 173.43,87 RELAY.3 | D7.C 161.87,87.69 162.56,87 | D8.A 164.52,86.42 165.1,87
  Bottom 0.254: v162.56,107.31 160.76,107.31 arc45 160.58,107.24 158.75,105.41 v158.75,87
N$11  (via drill 0.33)
  Top 0.254: R9.1 149.93,90.1 154.31,85.72 U1.18 | LED6.A v162.56,105.41
  Top 0.813: 158.75,83.19 U1.16 U1.17 U1.18 | 158.75,83.19 v159.38,83.19 161.29,83.19 162.56,83.19 | 162.56,83.19 173.74,83.19 RELAY.4 | D9.C 161.87,83.88 162.56,83.19 | D10.A 158.17,82.61 158.75,83.19
  Bottom 0.254: v162.56,105.41 161.4,105.41 arc45 161.22,105.34 159.38,103.5 v159.38,83.19
N$12
  Top 0.254: U1.3 143.75,95.89 R4.2
N$13
  Top 0.254: R5.4 143.91,90.57 145.41,92.08 U1.6
N$14
  Top 0.254: R5.6 143.91,89.77 145.41,88.27 U1.9
N$15
  Top 0.254: U1.12 143.75,84.45 R3.8
N$16
  Top 0.254: U1.4 146.07,94.38 R4.4 R4.6
N$17
  Top 0.254: U1.5 144.78,93.34 144.22,92.78 R4.8 R5.2
N$18
  Top 0.254: U1.10 144.15,87 143.51,87.63 143.11,87.63 R3.2 R5.8
N$19
  Top 0.254: R3.4 R3.6 144.54,85.96 144.78,85.72 U1.11
N$20
  Top 0.254: R7.4 143.91,71.52 145.41,73.03 U3.6
N$21
  Top 0.254: U3.5 144.78,74.3 144.22,73.73 R6.8 R7.2
N$22
  Top 0.254: U3.4 146.07,75.33 R6.4 R6.6
N$23
  Top 0.254: R7.8 R8.2 144.85,68.51 145.41,67.94 U3.10
N$24
  Top 0.254: R8.4 R8.6 144.54,66.91 144.78,66.67 U3.11
N$25  (via drill 0.33)
  Top 0.254: R10.7 149.93,71.19 154.31,75.56 U3.25 | LED7.A v162.56,103.5
  Top 0.813: 158.75,78.11 U3.27 U3.26 U3.25 | 158.75,78.11 v162.56,78.11 168.91,78.11 | 168.91,78.11 172.47,78.11 RELAY.5 | D11.C 168.22,78.8 168.91,78.11 | D12.A 158.17,77.53 158.75,78.11
  Bottom 0.254: v162.56,103.5 v162.56,78.11
N$26  (via drill 0.33)
  Top 0.254: R10.5 150.73,68.18 154.31,71.75 U3.22 | LED8.A v163.19,101.6
  Top 0.813: 158.75,74.3 U3.24 U3.23 U3.22 | 158.75,74.3 v163.19,74.3 163.83,74.3 168.91,74.3 | 168.91,74.3 172.16,74.3 RELAY.6 | D13.C 168.22,74.98 168.91,74.3 | D14.A 158.17,73.72 158.75,74.3
  Bottom 0.254: v163.19,101.6 v163.19,74.3
N$27  (via drill 0.33)
  Top 0.254: R10.3 151.53,65.17 154.31,67.94 U3.19 | LED9.A v170.81,99.69
  Top 0.813: 158.75,70.48 U3.21 U3.20 U3.19 | 158.75,70.48 168.91,70.48 | 168.91,70.48 171.84,70.48 RELAY.7 | D15.C 168.22,71.17 168.91,70.48 | D16.A 158.17,69.91 158.75,70.48
  Bottom 0.254: v170.81,99.69 170.81,75.71 arc45 170.89,75.53 RELAY.7
N$28  (via drill 0.33)
  Top 0.254: R10.1 152.33,64.7 153.67,66.04 155.96,66.04 | LED10.A 169.32,96.84 arc45 169.4,96.67 v169.54,96.52
  Top 0.813: 158.75,66.67 U3.18 155.96,66.04 U3.17 U3.16 | 158.75,66.67 168.91,66.67 | 168.91,66.67 v169.54,66.67 170.81,66.67 171.53,66.67 RELAY.8 | D17.C 168.22,67.36 168.91,66.67 | D18.A 158.17,66.09 158.75,66.67
  Bottom 0.254: v169.54,96.52 v169.54,66.67
N$29
  Top 0.254: R17.1 145.34,35.49 146.05,36.2 U4.16
  Top 0.813: U9.2 U9.1 156.84,32.96 | 156.84,32.96 153.67,32.96 | 153.67,32.96 151.82,32.96 148.59,36.2 U4.16 U4.17 U4.18 | D25.C 156.79,33.02 156.84,32.96 | D26.A 153.09,32.38 153.67,32.96
N$30
  Top 0.813: U7.3 U7.4 166.43,48.2 170.18,44.45 170.18,41.03 AUX.2
N$31
  Top 0.813: U8.3 U8.4 167.77,40.58 AUX.3
N$32
  Top 0.813: U9.3 U9.4 171.89,32.96 AUX.4
N$33
  Top 0.813: U10.3 U10.4 171.77,25.34 AUX.5
N$34
  Top 0.254: R17.7 142.94,44.52 146.05,47.62 U4.25
  Top 0.813: U6.2 U6.1 156.84,55.82 | 156.84,55.82 153.67,55.82 | 153.67,55.82 151.71,55.82 150.5,54.61 150.5,51.44 149.22,50.16 U4.27 U4.26 U4.25 | D20.A 153.09,55.24 153.67,55.82 | D19.C 156.79,55.88 156.84,55.82
N$35
  Top 0.254: R17.5 143.75,41.51 146.05,43.81 U4.22
  Top 0.813: U7.2 U7.1 156.84,48.2 | 156.84,48.2 153.67,48.2 | 153.67,48.2 151.07,48.2 149.22,46.35 U4.24 U4.23 U4.22 | D22.A 153.09,47.62 153.67,48.2 | D21.C 156.79,48.26 156.84,48.2
N$36
  Top 0.254: R17.3 144.54,38.5 146.05,40.01 U4.19
  Top 0.813: U8.2 U8.1 157.48,40.58 | 157.48,40.58 153.67,40.58 | 153.67,40.58 147.64,40.58 U4.19 U4.20 U4.21 | D24.A 153.09,40 153.67,40.58 | D23.C 156.79,41.27 157.48,40.58
N$37
  Top 0.813: U6.3 U6.4 165.16,55.82 173.89,47.09 AUX.1
N$38
  Top 0.254: R11.2 135.19,48.19 135.89,48.9 U4.3
N$39
  Top 0.254: R12.4 135.02,43.58 136.53,45.09 U4.6
N$40
  Top 0.254: R12.6 135.02,42.78 136.53,41.27 U4.9
N$41
  Top 0.254: R13.8 135.19,38.17 135.89,37.47 U4.12
N$42
  Top 0.254: U4.4 137.18,47.39 R11.4 R11.6
N$43
  Top 0.254: U4.5 135.89,46.35 135.32,45.79 R11.8 R12.2
N$44
  Top 0.254: R12.8 R13.2 135.32,40.57 135.89,40.01 U4.10
N$45
  Top 0.254: U4.11 137.18,38.97 R13.6 R13.4
N$46
  Top 0.254: R14.2 135.19,20.25 135.89,20.95 U5.3
N$47
  Top 0.254: R16.8 135.19,10.23 135.89,9.53 U5.12
N$48
  Top 0.254: R15.6 135.02,14.84 136.53,13.34 U5.9
N$49
  Top 0.254: R15.4 135.02,15.64 136.53,17.14 U5.6
N$50
  Top 0.254: U5.4 137.18,19.45 R14.4 R14.6
N$51
  Top 0.254: U5.5 135.89,18.41 135.32,17.85 R14.8 R15.2
N$52
  Top 0.254: R15.8 R16.2 135.32,12.63 135.89,12.06 U5.10
N$53
  Top 0.254: U5.11 137.18,11.03 R16.6 R16.4
N$54
  Top 0.254: R18.7 142.94,16.58 146.05,19.68 U5.25
  Top 0.813: U10.2 U10.1 157.48,25.34 | 157.48,25.34 153.67,25.34 | 153.67,25.34 152.34,25.34 149.22,22.23 U5.27 U5.26 U5.25 | D28.A 153.09,24.76 153.67,25.34 | D27.C 156.79,26.03 157.48,25.34
N$55
  Top 0.254: R18.5 143.75,13.57 146.05,15.88 U5.22
  Top 0.813: U11.2 U11.1 157.48,17.72 | 157.48,17.72 153.67,17.72 | 153.67,17.72 147.64,17.72 U5.23 | U5.24 U5.23 | U5.23 U5.22 | D30.A 153.09,17.14 153.67,17.72 | D29.C 156.79,18.41 157.48,17.72
N$56
  Top 0.254: R18.3 144.54,10.56 146.05,12.06 U5.19
  Top 0.813: U12.2 U12.1 157.48,10.1 | 157.48,10.1 152.4,10.1 | 152.4,10.1 151.19,10.1 149.22,12.06 U5.19 U5.20 U5.21 | D32.A 151.82,9.52 152.4,10.1 | D31.C 156.79,10.79 157.48,10.1
N$57
  Top 0.254: R18.1 145.34,7.55 146.05,8.26 U5.16
  Top 0.813: U13.2 U13.1 156.21,2.48 | 156.21,2.48 151.19,2.48 149.86,3.81 149.86,5.71 | 149.86,5.71 149.86,6.99 148.59,8.26 U5.16 U5.17 U5.18 | D33.C 155.52,3.17 156.21,2.48 | D34.A 150.5,6.35 149.86,5.71
N$58
  Top 0.813: U11.3 U11.4 167.65,17.72 AUX.6
N$59
  Top 0.813: U12.3 U12.4 167.58,10.1 171.45,13.97 171.45,18.02 AUX.7
N$60
  Top 0.813: U13.3 U13.4 166.31,2.48 167.64,3.81 167.64,8.26 173.99,14.61 173.99,16.86 AUX.8
N$61
  Top 0.254: C1.2 163.62,63.28 163.19,62.87 U6.6
N$62
  Top 0.254: C21.2 30.06,68.16 28.57,66.67 28.57,64.19 U14.1
N$63
  Top 0.813: U14.8 37.22,64.14 D35.C | D35.C 38.68,64.38 L1.1 | C21.1 D35.C
N$64
  Top 0.254: C2.2 163.62,51.65 163.19,52.07 U7.6
N$65
  Top 0.254: C3.2 163.62,44.03 163.19,44.45 U8.6
N$66
  Top 0.254: C4.2 163.62,36.41 163.19,36.83 U9.6
N$68
  Top 0.254: R21.2 C22.2
N$69
  Top 0.254: C20.1 28.57,60.27 U14.4
N$70
  Top 0.254: C23.1 C22.1 32.26,58.13 32.26,60.83 33.02,61.59 U14.6
N$71
  Bottom 0.406: U$1.49 U$5.24
N$72
  Top 0.254: C31.1 111.4,4.03 U15.4
N$73
  Top 0.254: U14.5 34.82,60.33 arc-45 35,60.25 36.2,59.05 R23.2 36.3,58 arc-45 36.47,57.93 R22.1
N$74
  Top 0.254: C9.2 163.62,28.79 163.19,29.21 U10.6
N$75
  Top 0.254: C10.2 163.62,21.17 163.19,21.59 U11.6
N$76
  Top 0.254: C11.2 163.62,13.55 163.19,13.97 U12.6
N$77
  Top 0.254: C12.2 160.02,3.81 163.19,6.99 U13.6
N$78
  Top 0.254: C32.2 106.89,5.5 107.31,5.08 U15.1
N$79
  Top 0.254: C32.1 105.56,7.2 U15.8
  Top 0.813: L2.1 114.1,11.62 D36.C
  Top 1.016: U15.8 107.31,10.79 107.95,11.43 109.03,11.43 L2.1
N$80
  Top 0.254: C33.2 R26.2
N$81
  Top 0.254: U15.6 109.86,10.03 110.24,10.41 112.78,10.41 113.03,10.16 | 113.03,10.16 C33.1 | C34.1 116.84,10.16 116.59,10.41 113.28,10.41 113.03,10.16
N$82
  Top 0.178: 104.14,6.35 108.58,6.35
  Top 0.254: R28.2 R27.1 102.87,7.62 104.14,6.35 | 108.58,6.35 109.22,6.99 110.49,6.99 111.12,7.62 U15.5
N$83
  Top 0.406: I1/V2.1 F1.2
N$86
  Top 0.406: I2/V3.1 F4.2
N$87
  Top 0.406: I3/V4.1 F5.2
N$88
  Top 0.406: I4.1 F6.2
N$89
  Top 0.813: F7.2 85.72,13.59 SERVO_AUX1.2
N$90
  Top 0.813: F8.2 92.08,13.59 SERVO_AUX2.2
N$91
  Bottom 0.406: U2.7 JP10.1
N$92
  Bottom 0.406: JP10.2 U2.6
N$93
  Top 0.813: F9.2 97.67,18.57 arc45 97.49,18.49 STEERING.2
N$94
  Top 0.254: R29.1 123.61,56.73 U2.A0 120.23,56.73 R30.2
  Bottom 0.406: JP11.8 U2.A0
N$95
  Bottom 0.406: U2.17 JP13.5
N$96
  Bottom 0.406: JP13.6 U2.16
N$97
  Bottom 0.406: U2.15 JP13.7
N$98
  Bottom 0.406: JP13.8 U2.14
N$99
  Bottom 0.406: JP14.8 73.41,49.53 U2.8
N$100
  Bottom 0.406: U2.9 68.83,46.74 68.58,46.99 JP14.7
N$101
  Bottom 0.406: JP14.6 73.41,44.45 U2.10
N$102
  Bottom 0.406: U2.11 68.71,41.66 JP14.5
N$103
  Bottom 0.406: JP14.4 73.41,39.37 U2.12
N$104
  Bottom 0.406: U$2.5 U$1.88
N$105
  Bottom 0.406: U$2.6 U$1.86
N$106
  Bottom 0.406: U$2.7 U$1.84
N$107
  Bottom 0.406: U$1.82 U$2.8
N$108
  Bottom 0.406: U$2.10 U$1.78
N$109
  Bottom 0.406: U$1.76 U$2.11
N$110
  Bottom 0.406: U$2.12 U$1.74
N$111
  Bottom 0.406: U$2.16 U$1.66
N$112
  Bottom 0.406: U$1.64 U$2.17
N$113
  Bottom 0.406: U$2.18 U$1.62
N$114
  Bottom 0.406: U$2.19 U$1.60
N$115
  Bottom 0.406: U$1.58 U$2.20
N$116
  Bottom 0.406: U$2.21 U$1.56
N$117
  Bottom 0.406: U$1.54 U$2.22
N$118
  Bottom 0.406: U$2.24 U$1.50
N$119
  Bottom 0.406: U$3.2 U$1.46
N$120
  Bottom 0.406: U$1.44 U$3.3
N$121
  Bottom 0.406: U$3.4 U$1.42
N$122
  Bottom 0.406: U$1.40 U$3.5
N$123
  Bottom 0.406: U$3.6 U$1.38
N$124
  Bottom 0.406: U$1.36 U$3.7
N$125
  Bottom 0.406: U$1.34 U$3.8
N$126
  Bottom 0.406: U$1.32 U$3.9
N$127
  Bottom 0.406: U$1.30 U$3.10
N$128
  Bottom 0.406: U$3.11 U$1.28
N$129
  Bottom 0.406: U$1.26 U$3.12
N$130
  Bottom 0.406: U$3.13 U$1.24
N$131
  Bottom 0.406: U$1.22 U$3.14
N$132
  Bottom 0.406: U$3.15 U$1.20
N$133
  Bottom 0.406: U$1.18 U$3.16
N$134
  Bottom 0.406: U$3.17 U$1.16
N$135
  Bottom 0.406: U$1.14 U$3.18
N$136
  Bottom 0.406: U$3.19 U$1.12
N$137
  Bottom 0.406: U$1.10 U$3.20
N$138
  Bottom 0.406: U$3.21 U$1.8
N$139
  Bottom 0.406: U$1.6 U$3.22
N$140
  Bottom 0.406: U$1.4 U$3.23
N$141
  Bottom 0.406: U$1.45 U$4.2
N$142
  Bottom 0.406: U$4.3 U$1.43
N$143
  Bottom 0.406: U$1.41 U$4.4
N$144
  Bottom 0.406: U$4.5 U$1.39
N$145
  Bottom 0.406: U$1.37 U$4.6
N$146
  Bottom 0.406: U$4.7 U$1.35
N$147
  Bottom 0.406: U$1.33 U$4.8
N$148
  Bottom 0.406: U$1.31 U$4.9
N$149
  Bottom 0.406: U$4.10 U$1.29
N$150
  Bottom 0.406: U$1.27 U$4.11
N$151
  Bottom 0.406: U$4.12 U$1.25
N$152
  Bottom 0.406: U$1.23 U$4.13 15.24,60.96
N$153
  Bottom 0.406: U$4.14 U$1.21
N$154
  Bottom 0.406: U$1.19 U$4.15
N$155
  Bottom 0.406: U$4.16 U$1.17
N$156
  Bottom 0.406: U$1.15 U$4.17 15.24,50.8
N$157
  Bottom 0.406: U$4.18 U$1.13
N$158
  Bottom 0.406: U$1.11 U$4.19
N$159
  Bottom 0.406: U$4.20 U$1.9
N$160
  Bottom 0.406: U$1.7 U$4.21
N$161
  Bottom 0.406: U$4.22 U$1.5
N$162
  Bottom 0.406: U$1.3 U$4.23
N$163
  Bottom 0.406: U$1.87 U$5.5
N$164
  Bottom 0.406: U$1.85 U$5.6
N$165
  Bottom 0.406: U$5.7 U$1.83
N$166
  Bottom 0.406: U$1.81 U$5.8
N$167
  Bottom 0.406: U$5.9 U$1.79
N$168
  Bottom 0.406: U$1.77 U$5.10
N$169
  Bottom 0.406: U$5.11 U$1.75
N$170
  Bottom 0.406: U$1.73 U$5.12
N$171
  Bottom 0.406: U$5.13 U$1.71
N$172
  Bottom 0.406: U$1.69 U$5.14
N$173
  Bottom 0.406: U$5.16 U$1.65
N$174
  Bottom 0.406: U$1.63 U$5.17
N$175
  Bottom 0.406: U$5.18 U$1.61
N$176
  Bottom 0.406: U$1.55 U$5.21
N$177
  Top 0.254: REV.C PWR.A 47.97,104.27 arc45 48.05,104.44 R24.1
N$178
  Top 0.254: R25.2 LED3.C
N$179
  Top 0.254: R31.2 LED4.C
N$180
  Top 0.254: R32.2 LED5.C
N$181
  Top 0.254: R33.2 LED6.C
N$182
  Top 0.254: R38.1 5V/1-STAT.A
N$183
  Top 0.254: 7V4-STAT.A R39.1
N$186
  Top 0.254: R34.2 LED7.C
N$187
  Top 0.254: R35.2 LED8.C
N$188
  Top 0.254: R36.2 LED9.C
N$189
  Top 0.254: R37.2 LED10.C
RELAY1  (via drill 0.33)
  Top 0.254: U2.52 114.3,98.3 JP15.1 | R4.1 141.44,101.44 v141.6,101.6
  Bottom 0.254: v141.6,101.6 119.38,101.6 118.11,100.33 115.57,100.33 U2.52
RELAY1FB  (via drill 0.33)
  Top 0.254: JP16.1 U2.53 | R4.3 140.57,94.38 140.34,94.61 v140.34,106.68
  Bottom 0.254: v140.34,106.68 115.44,106.68 JP16.1
RELAY2  (via drill 0.33)
  Top 0.254: U2.51 JP16.2 | R5.3 140.57,90.57 138.81,92.33 138.81,106.43 v140.34,107.95 | v116.33,107.57 116.33,106.55 v115.57,105.79
  Bottom 0.254: v140.34,107.95 139.7,107.31 116.59,107.31 v116.33,107.57 | v115.57,105.79 113.41,105.79 U2.51
RELAY2FB  (via drill 0.33)
  Top 0.254: R5.1 140.53,91.37 139.57,92.33 v139.57,100.84 | U2.50 111.76,98.55 JP15.2
  Bottom 0.254: v139.57,100.84 139.32,101.09 119.63,101.09 117.6,99.06 113.54,99.06 JP15.2
RELAY3  (via drill 0.33)
  Top 0.254: U2.48 109.22,98.3 JP15.3 | R5.5 140.61,89.77 138.3,92.08 138.3,99.82 v137.79,100.33
  Bottom 0.254: v137.79,100.33 137.54,100.58 119.89,100.58 115.44,96.14 111.38,96.14 JP15.3
RELAY3FB  (via drill 0.33)
  Top 0.254: JP16.3 U2.49 | R5.7 140.65,88.97 137.79,91.82 137.79,99.31 137.03,100.08 137.03,100.97 138.3,102.23 138.3,106.93 v139.32,107.95
  Bottom 0.254: v139.32,107.95 117.09,107.95 115.7,109.35 110.74,109.35 JP16.3
RELAY4  (via drill 0.33)
  Top 0.254: JP16.4 U2.47 | R3.7 140.9,85.16 136.53,89.53 v136.53,108.58
  Bottom 0.254: v136.53,108.58 117.09,108.58 115.82,109.86 108.46,109.86 JP16.4
RELAY4FB  (via drill 0.33)
  Top 0.254: U2.46 106.68,98.55 JP15.4 | R3.5 140.74,85.96 137.16,89.53 v137.16,97.79
  Bottom 0.254: v137.16,97.79 117.73,97.79 115.57,95.63 109.6,95.63 JP15.4
RELAY5  (via drill 0.33)
  Top 0.254: U2.44 104.14,98.3 JP15.5 v104.78,88.9 | R6.1 141.44,83.35 v137.16,87.63
  Bottom 0.254: v137.16,87.63 116.84,87.63 115.57,88.9 v104.78,88.9
RELAY5FB  (via drill 0.33)
  Top 0.254: JP16.5 U2.45 105.41,102.87 105.41,100.33 106.05,99.69 v106.05,90.17 | R6.3 140.95,75.33 140.59,75.69 140.59,82.93 135.89,87.63 v135.89,90.17
  Bottom 0.254: v135.89,90.17 v106.05,90.17
RELAY6  (via drill 0.33)
  Top 0.254: JP16.6 U2.43 102.87,102.87 102.87,100.33 103.5,99.69 v103.5,94.61 | R7.3 139.94,71.52 139.06,72.39 139.06,83.19 134.62,87.63 v134.62,95.25
  Bottom 0.254: v134.62,95.25 116.2,95.25 115.57,94.61 v103.5,94.61
RELAY6FB  (via drill 0.33)
  Top 0.254: U2.42 101.6,98.55 JP15.6 v102.23,92.71 | R6.7 140.9,73.73 139.7,74.93 139.7,83.19 135.25,87.63 v135.25,92.71
  Bottom 0.254: v135.25,92.71 v102.23,92.71
RELAY7  (via drill 0.33)
  Top 0.254: R7.5 140.1,70.72 138.43,72.39 138.43,82.55 v135.89,85.09 | v99.69,83.82 JP15.7 99.06,98.3 U2.40
  Bottom 0.254: v135.89,85.09 116.84,85.09 115.57,83.82 v99.69,83.82
RELAY7FB  (via drill 0.33)
  Top 0.254: R7.7 140.26,69.92 137.79,72.39 137.79,81.92 v137.16,82.55 | v100.97,82.55 100.97,99.69 100.33,100.33 100.33,102.87 U2.41 JP16.7
  Bottom 0.254: v137.16,82.55 v100.97,82.55
RELAY8  (via drill 0.33)
  Top 0.254: R8.7 140.26,66.11 136.53,69.85 v136.53,78.74 | v98.42,79.38 98.42,100.33 97.79,100.97 97.79,102.87 U2.39 JP16.8
  Bottom 0.254: v136.53,78.74 135.89,79.38 v98.42,79.38
RELAY8FB  (via drill 0.33)
  Top 0.254: R8.5 140.1,66.91 137.16,69.85 137.16,79.38 v136.53,80.01 | v97.16,80.01 JP15.8 96.52,98.55 U2.38
  Bottom 0.254: v136.53,80.01 v97.16,80.01
RX0  (via drill 0.33)
  Top 0.254: v57.78,69.85 57.78,62.23 U$1.70
  Bottom 0.254: JP10.8 67.94,71.12 66.67,69.85 v57.78,69.85
  Bottom 0.406: U$2.14 U$1.70 | U2.0 JP10.8
RX1  (via drill 0.33)
  Top 0.254: U$5.15 63.5,58.42 64.9,59.82 64.9,87.12 v65.41,87.63
  Bottom 0.254: v65.41,87.63 67.44,87.63 JP13.3
  Bottom 0.406: U$1.67 U$5.15 | JP13.3 U2.19
SCL  (via drill 0.33)
  Top 0.254: R19.1 92.29,61.51 HTU21D.SCL IMU.SCL v93.98,93.98
  Bottom 0.254: U2.21 v93.98,93.98
  Bottom 0.406: JP13.1 U2.21
SDA  (via drill 0.33)
  Top 0.254: R20.1 98.21,61.25 HTU21D.SDA IMU.SDA v96.52,91.44
  Bottom 0.254: U2.20 v96.52,91.44
  Bottom 0.406: U2.20 JP13.2
SERVO_AUX1  (via drill 0.33)
  Top 0.254: U2.4 73.03,60.96 70.48,58.42 v70.48,19.05
  Bottom 0.254: v70.48,19.05 SERVO_AUX1.3
  Bottom 0.406: JP10.4 U2.4
SERVO_AUX2  (via drill 0.33)
  Top 0.254: U2.5 73.03,58.42 71.75,57.15 v71.75,26.04 | v88.9,23.5 SERVO_AUX2.3
  Bottom 0.254: v71.75,26.04 74.93,26.04 77.47,23.5 v88.9,23.5
  Bottom 0.406: U2.5 JP10.3
SERVO_EN  (via drill 0.33)
  Top 0.254: U15.3 v109.86,1.91 | v78.11,1.91 78.11,24.13 75.56,26.67 75.56,64.14 U2.2
  Bottom 0.254: v109.86,1.91 v78.11,1.91
  Bottom 0.406: U2.2 JP10.6
STEERING  (via drill 0.33)
  Top 0.254: STEERING.3 v95.25,20.95 | v76.83,20.95 76.83,24.13 75.06,25.91 75.06,62.1 U2.3
  Bottom 0.254: v95.25,20.95 v76.83,20.95
  Bottom 0.406: JP10.5 U2.3
SYS_5V  (via drill 0.33)
  Top 0.254: v40.64,41.91 GPS.VIN
  Bottom 0.254: U$1.53 59.05,41.27 58.42,41.91 v40.64,41.91
  Bottom 0.406: U$5.22 U$1.53
TX0  (via drill 0.33)
  Top 0.254: R2.1 D2.C 69.33,64.65 69.22,64.77 v67.31,64.77
  Bottom 0.254: v67.31,64.77 57.78,64.77 U$1.72
  Bottom 0.406: U$1.72 U$2.13
TX1  (via drill 0.33)
  Top 0.254: R1.2 D1.C 70.36,83.06 69.85,82.55 v67.31,82.55 | v54.61,82.55 54.61,60.33 U$1.68
  Bottom 0.254: v67.31,82.55 v54.61,82.55
  Bottom 0.406: U$1.68 U$2.15
V2  (via drill 0.33)
  Top 0.254: v123.83,36.83 123.83,53.34 127,56.52 127,59.82 JP11.7
  Bottom 0.254: I1/V2.3 v123.83,36.83
  Bottom 0.406: U2.A1 JP11.7
V3  (via drill 0.33)
  Top 0.254: v95.25,52.7 95.25,46.35 93.34,44.45 93.34,38.1 94.54,36.9 arc45 94.72,36.83 I2/V3.3 | v115.57,52.7 115.57,57.15 117.47,59.05 117.47,68.58 113.03,73.03 113.03,80.64 117.47,85.09 117.47,94.61 U2.A15
  Bottom 0.254: v95.25,52.7 v115.57,52.7
  Bottom 0.406: JP12.1 U2.A15
V4  (via drill 0.33)
  Top 0.254: v98.42,36.83 v98.42,52.07 | v116.2,52.07 116.2,57.15 118.11,59.05 118.11,68.58 113.67,73.03 113.67,80.64 118.11,85.09 118.11,92.71 U2.A14
  Bottom 0.254: v98.42,52.07 v116.2,52.07 | I3/V4.3 v98.42,36.83
  Bottom 0.406: U2.A14 JP12.2

## Text on the board
tNames: +12V | GND